# EAGLE design 4ButtonSwitch.ItsyBitsyM0.Rev1.1 (EAGLE 8.6.0)
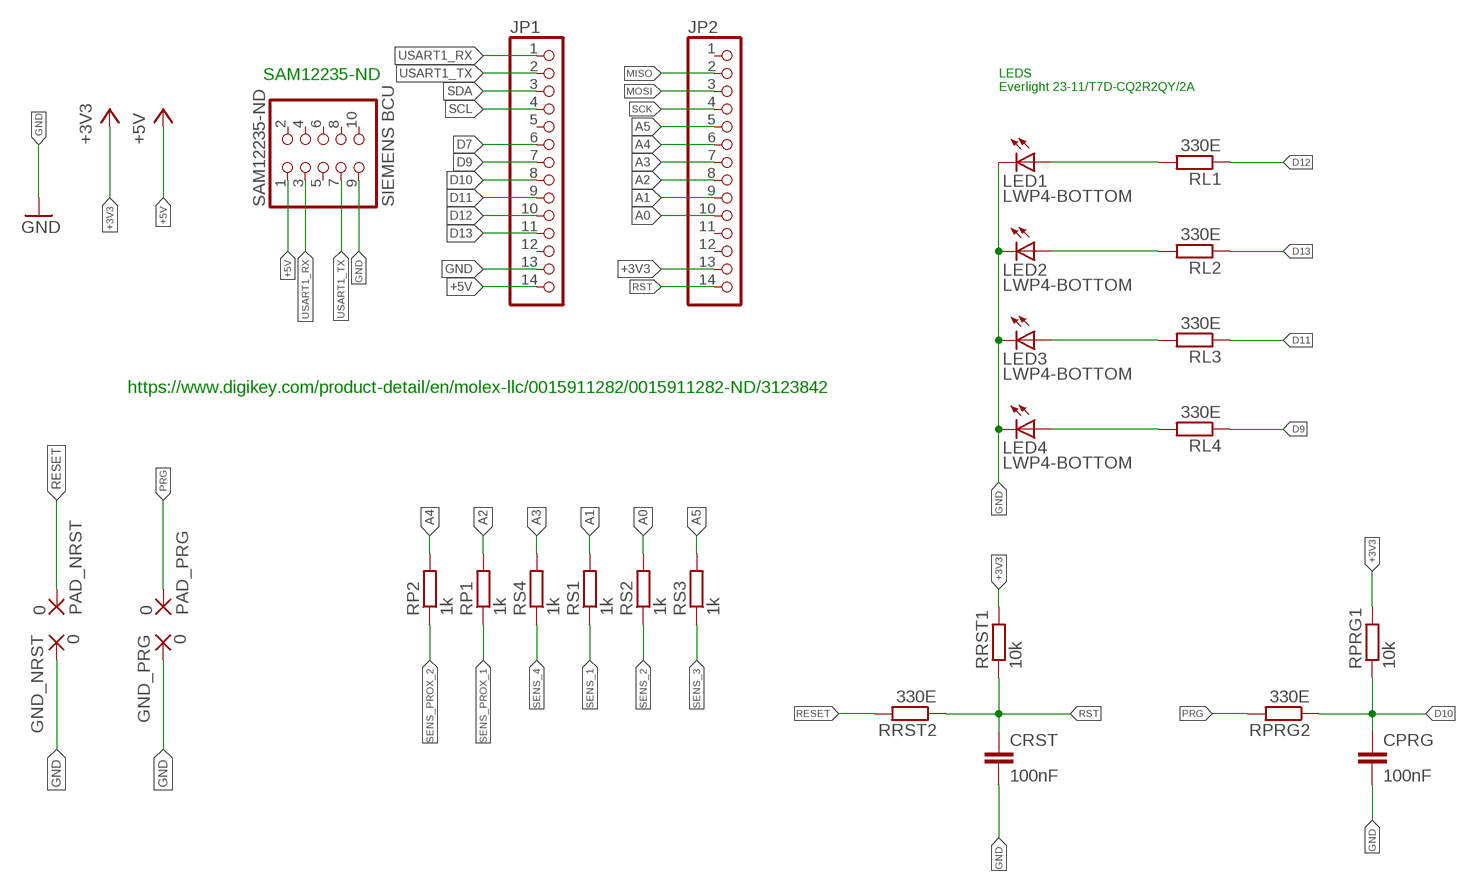
[diagram p0: schematic, sheet 1]

## Parts
CPRG  100nF  C-EUC1206  [C1206]
CRST  100nF  C-EUC1206  [C1206]
GND_NRST  0  SMD5  [SMD2,54-5,08]
GND_PRG  0  SMD5  [SMD2,54-5,08]
JP1  PINHD-1X141X14_SMT  [1X14_SMT]
JP2  PINHD-1X141X14_SMT  [1X14_SMT]
LED1  LWP4-BOTTOM  [P47F-BOTTOM]
LED2  LWP4-BOTTOM  [P47F-BOTTOM]
LED3  LWP4-BOTTOM  [P47F-BOTTOM]
LED4  LWP4-BOTTOM  [P47F-BOTTOM]
PAD_NRST  0  SMD5  [SMD2,54-5,08]
PAD_PRG  0  SMD5  [SMD2,54-5,08]
RL1  330E  R-EU_R1206  [R1206]
RL2  330E  R-EU_R1206  [R1206]
RL3  330E  R-EU_R1206  [R1206]
RL4  330E  R-EU_R1206  [R1206]
RP1  1k  R-EU_R1206  [R1206]
RP2  1k  R-EU_R1206  [R1206]
RPRG1  10k  R-EU_R1206  [R1206]
RPRG2  330E  R-EU_R1206  [R1206]
RRST1  10k  R-EU_R1206  [R1206]
RRST2  330E  R-EU_R1206  [R1206]
RS1  1k  R-EU_R1206  [R1206]
RS2  1k  R-EU_R1206  [R1206]
RS3  1k  R-EU_R1206  [R1206]
RS4  1k  R-EU_R1206  [R1206]
SAM12235-ND  SIEMENS BCU  PINHD-2X5_2.54-SMD  [2X05SMD]

## Nets
+3V3: JP2.13 RPRG1.2 RRST1.2
+5V: JP1.14 SAM12235-ND.1
A0: JP2.10 RS2.2
A1: JP2.9 RS1.2
A2: JP2.8 RP1.2
A3: JP2.7 RS4.2
A4: JP2.6 RP2.2
A5: JP2.5 RS3.2
D7: JP1.6
D9: JP1.7 RL4.1
D10: CPRG.1 JP1.8 RPRG1.1 RPRG2.1
D11: JP1.9 RL3.1
D12: JP1.10 RL1.1
D13: JP1.11 RL2.1
GND: CPRG.2 CRST.2 GND_NRST.1(P) GND_PRG.1(P) JP1.13 LED1.C LED2.C LED3.C LED4.C SAM12235-ND.9
MISO: JP2.2
MOSI: JP2.3
N$19: LED1.A RL1.2
N$20: LED2.A RL2.2
N$21: LED3.A RL3.2
N$22: LED4.A RL4.2
PRG: PAD_PRG.1(P) RPRG2.2
RESET: PAD_NRST.1(P) RRST2.2
RST: CRST.1 JP2.14 RRST1.1 RRST2.1
SCK: JP2.4
SCL: JP1.4
SDA: JP1.3
SENS_1: RS1.1
SENS_2: RS2.1
SENS_3: RS3.1
SENS_4: RS4.1
SENS_PROX_1: RP1.1
SENS_PROX_2: RP2.1
USART1_RX: JP1.1 SAM12235-ND.3
USART1_TX: JP1.2 SAM12235-ND.7
Unconnected: JP1.5 JP1.12 JP2.1 JP2.11 JP2.12 SAM12235-ND.2 SAM12235-ND.4 SAM12235-ND.5 SAM12235-ND.6 SAM12235-ND.8 SAM12235-ND.10

## Notes on the sheet
- SAM12235-ND
- LEDS
  Everlight 23-11/T7D-CQ2R2QY/2A
- https://www.digikey.com/product-detail/en/molex-llc/0015911282/0015911282-ND/3123842

## Library data of the parts
CPRG CRST = rcl:C-EU: CAPACITOR, European symbol; SPICEPREFIX: C
GND_NRST GND_PRG PAD_NRST PAD_PRG = wirepad:SMD5: SMD PAD
JP1 JP2 = pinhead+:PINHD-1X14: PIN HEADER
LED1-LED4 = led:*P4: PointLED® Enhanced Thinfilm LED TOP & BOTTOM mount LS P47F, LR P47F, LA P47F, LY P47F, LT P4SG, LB P4SG, LW P4SG Source: http://catalog.osram-os.com .. LA_LR_LS_LY_P47F_Pb_free.pdf
RL1-RL4 RP1 RP2 RPRG1 RPRG2 RRST1 RRST2 RS1-RS4 = resistor:R-EU_: RESISTOR, European symbol
SAM12235-ND = pinhead:PINHD-2X5: PIN HEADER

## Board
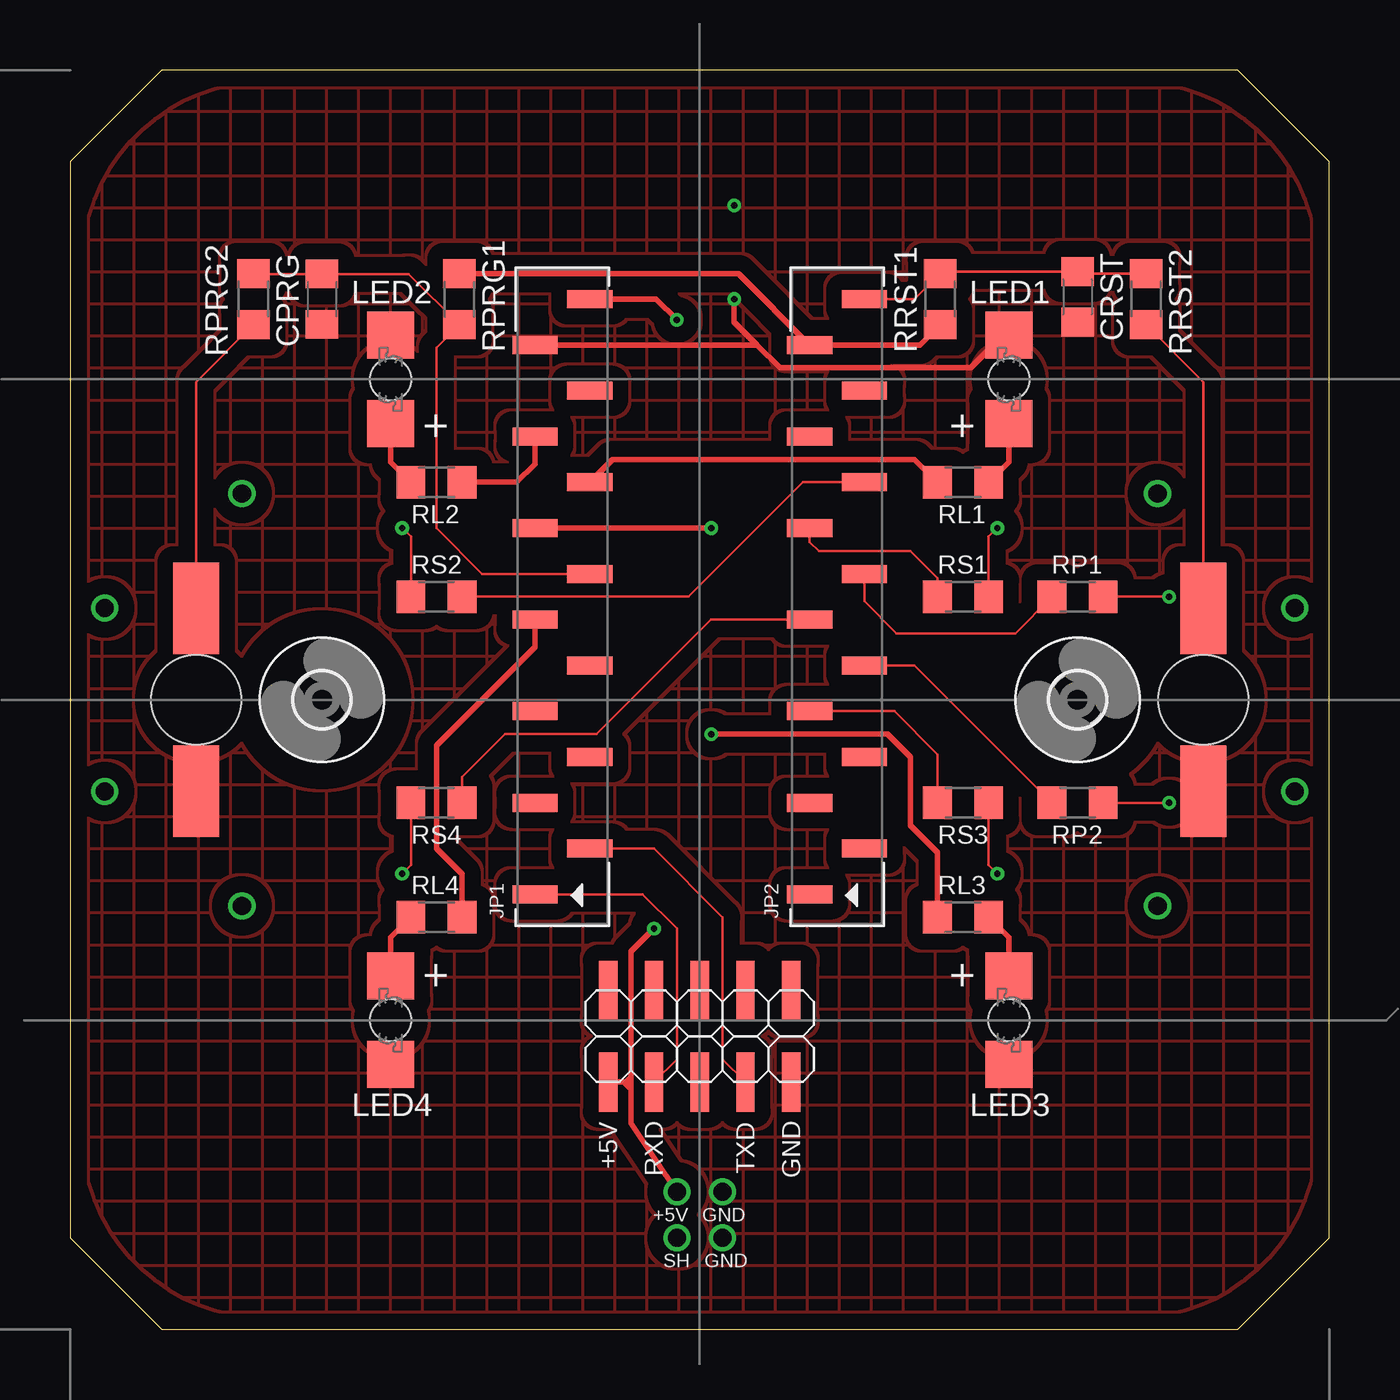
[diagram p1: board, top side]
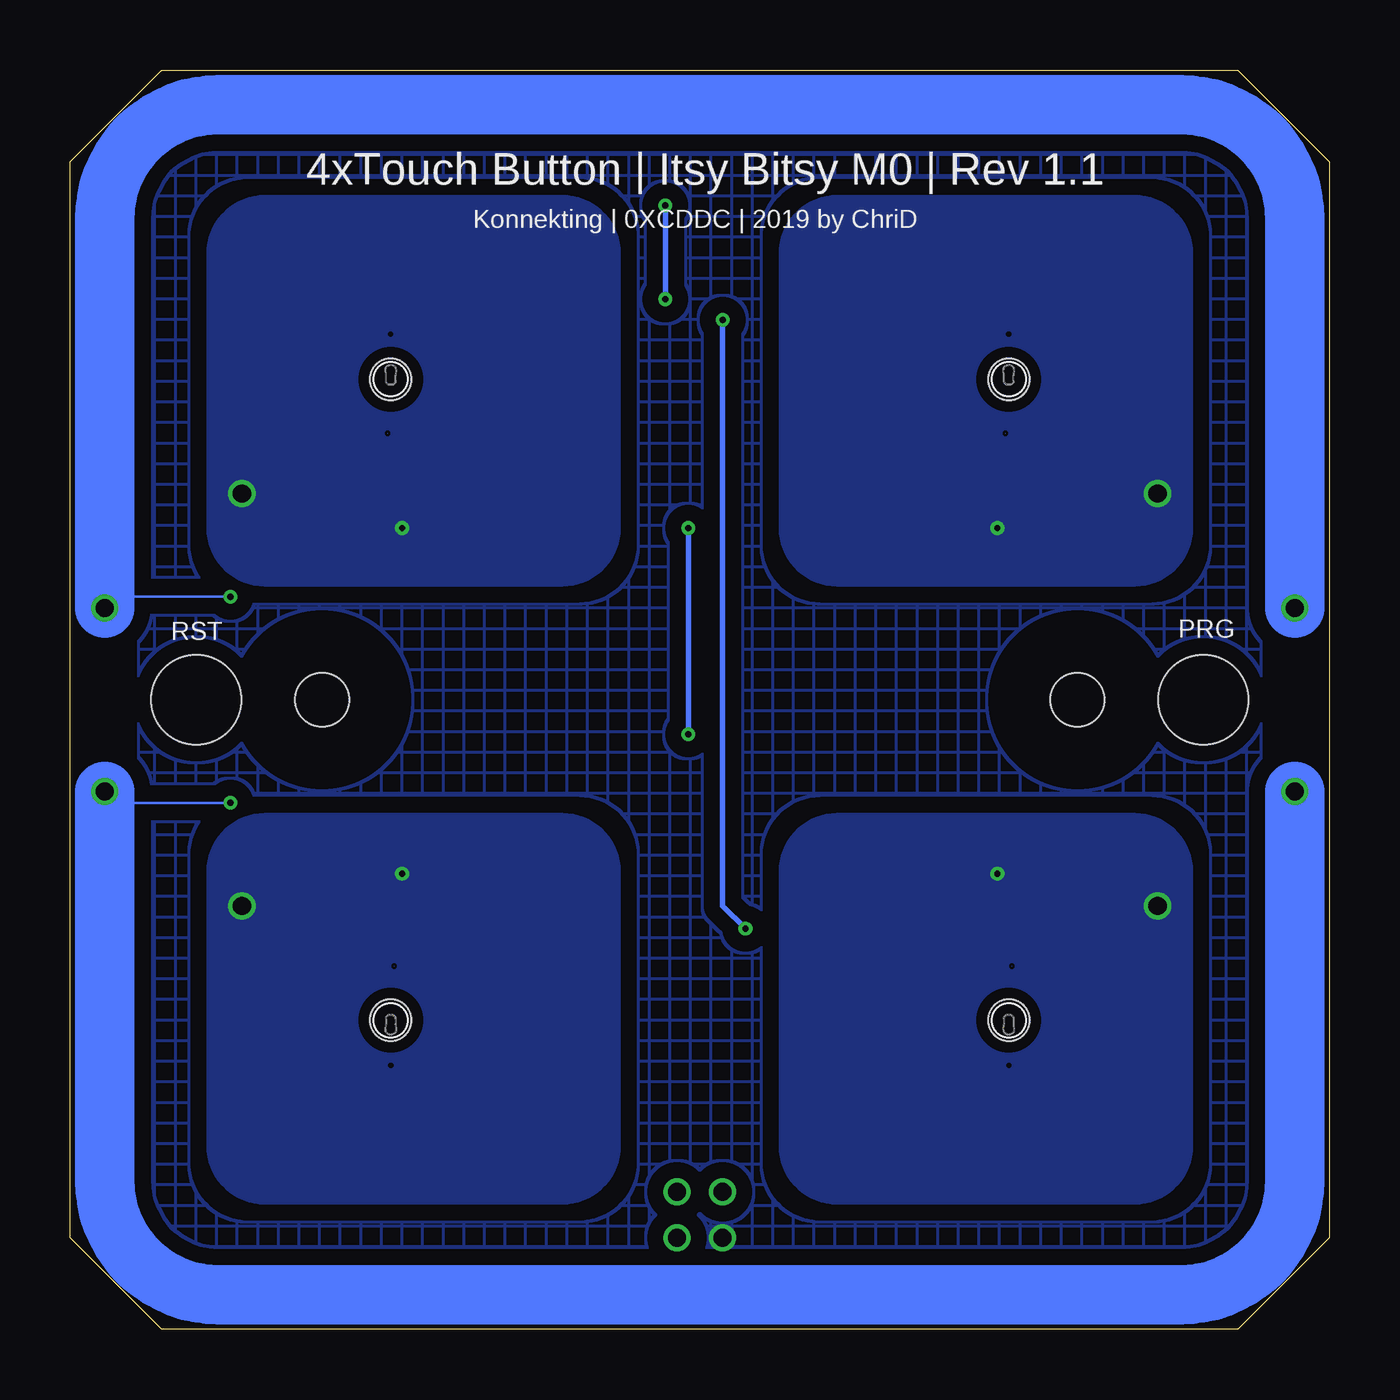
[diagram p2: board, bottom side, seen from below]

Size 69.85 x 69.85 mm. Coordinates in mm from the lower left corner, seen from the top.
Outline: 5.08,69.85 64.77,69.85 69.85,64.77 69.85,5.08 64.77,0 5.08,0 0,5.08 0,64.77 5.08,69.85
Outline: 6.34,69.84 5.08,69.85
Copper layers (1*16): Top 0.035mm / dielectric 1.5mm / Bottom 0.035mm
Design rules "konnektduino": minimum track width 6mil, minimum drill 0.35mm, track to track 6mil, track to pad 6mil, pad to pad 6mil, via to via 6mil, smd to smd 6mil, copper to edge 25mil, drill to drill 6mil, minimum pad ring 10mil, minimum via ring 8mil, stop-mask expansion 1mil, vias tented up to drill 25mil, thermal gap 10mil
Holes 5 mm at 62.87,34.92 6.99,34.92

### Footprints (pad centres in the part's own frame; a part is rotated, then mirrored left to right if it is on the bottom)
C1206 = smd 1.6 x 1.8: 1 -1.4,0; 2 1.4,0
SMD2,54-5,08 = smd 2.54 x 5.08: 1 0,0
1X14_SMT = smd 1 x 2.5: 1 -16.51,1.52; 2 -13.97,-1.52; 3 -11.43,1.52; 4 -8.89,-1.52; 5 -6.35,1.52; 6 -3.81,-1.52; 7 -1.27,1.52; 8 1.27,-1.52; 9 3.81,1.52; 10 6.35,-1.52; 11 8.89,1.52; 12 11.43,-1.52; 13 13.97,1.52; 14 16.51,-1.52
P47F-BOTTOM = smd 2.6 x 2.6: A -2.45,0; C 2.45,0 | hole 2.3: 0,0
R1206 = smd 1.6 x 1.803: 1 -1.422,0; 2 1.422,0
2X05SMD = smd 1.016 x 3.302: 1 -1.27,-3.81; 2 -1.27,1.27; 3 1.27,-3.81; 4 1.27,1.27; 5 3.81,-3.81; 6 3.81,1.27; 7 6.35,-3.81; 8 6.35,1.27; 9 8.89,-3.81; 10 8.89,1.27
3,0 = hole 3: 0,0

### Placement (x,y rotation side)
CPRG  13.97,57.15 270 top
CRST  55.88,57.28 270 top
GND_NRST  6.99,29.84 0 top
GND_PRG  62.87,29.84 0 top
JP1  27.3,40.64 90 top
JP2  42.55,40.64 90 top
LED1  52.07,52.7 90 top
LED2  17.78,52.7 90 top
LED3  52.07,17.14 270 top
LED4  17.78,17.14 270 top
PAD_NRST  62.87,40.01 0 top
PAD_PRG  6.99,40.01 0 top
RL1  49.53,46.99 0 top
RL2  20.32,46.99 180 top
RL3  49.53,22.86 0 top
RL4  20.32,22.86 180 top
RP1  55.88,40.64 180 top
RP2  55.88,29.21 180 top
RPRG1  21.59,57.15 90 top
RPRG2  10.16,57.15 270 top
RRST1  48.26,57.15 270 top
RRST2  59.69,57.15 270 top
RS1  49.53,40.64 180 top
RS2  20.32,40.64 0 top
RS3  49.53,29.21 180 top
RS4  20.32,29.21 0 top
SAM12235-ND  31.11,17.53 0 top
U$1  [3,0]  13.97,34.92 0 top
U$2  [3,0]  55.88,34.92 0 top

### Tracks (layer width: path | path; a pad name or v marks a point on that pad's centre or on a via)
+3V3
  Top 0.305: RPRG1.2 37.06,58.57 JP2.13 47.14,54.61 RRST1.2
+5V  (via drill 0.35, 1)
  Top 0.305: SAM12235-ND.1 30.73,13.72 | 30.73,13.72 30.86,13.72 31.11,13.97 | JP1.14 32.51,57.15 v33.66,56.01 | v33.66,7.62 31.11,11.43 31.11,13.34 | 31.11,13.34 31.11,13.97 | 30.73,13.72 31.11,13.34 | 31.11,13.97 31.11,20.95 v32.38,22.23
  Bottom 0.305: v32.38,22.23 33.66,23.5 v33.66,56.01
A0
  Top 0.152: RS2.2 34.29,40.64 40.64,46.99 JP2.10
A1
  Top 0.152: JP2.9 41.02,43.68 41.53,43.18 46.61,43.18 48.11,41.68 RS1.2
A2
  Top 0.152: JP2.8 44.06,40.39 45.85,38.61 52.43,38.61 RP1.2
A3
  Top 0.152: RS4.2 21.74,30.63 24.13,33.02 29.21,33.02 35.56,39.37 JP2.7
A4
  Top 0.152: JP2.6 46.84,36.83 RP2.2
A5
  Top 0.152: RS3.2 48.11,31.9 45.72,34.29 JP2.5
D9
  Top 0.305: RL4.1 21.74,25.25 20.32,26.67 20.32,32.38 25.79,37.85 JP1.7
D10
  Top 0.152: RPRG2.1 10.18,58.55 CPRG.1 18.77,58.55 RPRG1.1 20.32,54.46 20.32,44.45 22.86,41.91 JP1.8
D11  (via drill 0.35)
  Top 0.305: v35.56,44.45 JP1.9 | v35.56,33.02 45.34,33.02 46.61,31.75 46.61,27.94 48.11,26.44 RL3.1
  Bottom 0.305: v35.56,44.45 v35.56,33.02
D12
  Top 0.305: RL1.1 46.84,48.26 30.09,48.26 JP1.10
D13
  Top 0.305: JP1.11 25.79,48.01 24.77,46.99 RL2.1
GND  (via drill 0.35, 1)
  Top 0.305: 38.1,54.61 39.37,53.34 49.97,53.34 51.27,54.64 51.56,54.64 LED1.C | JP1.13 38.1,54.61 | 38.1,54.61 36.83,55.88 v36.83,57.15
  Bottom 0.305: v36.83,57.15 v36.83,62.36
  other vias: 36.2,7.62 36.2,5.08
  pour Top (isolate 0.889, rank 6, no thermals, hatched): 0.64,10.79 arc90 10.79,0.64 59.05,0.64 arc90 69.22,10.79 69.22,59.05 arc90 59.05,69.22 10.79,69.22 arc90 0.64,59.05
N$19
  Top 0.305: LED1.A 52.07,48.11 RL1.2
N$20
  Top 0.305: LED2.A 17.78,48.11 RL2.2
N$21
  Top 0.305: LED3.A 52.07,21.74 RL3.2
N$22
  Top 0.305: LED4.A 17.78,21.74 RL4.2
PRG
  Top 0.152: PAD_PRG.1 6.99,52.55 RPRG2.2
RESET
  Top 0.152: PAD_NRST.1 62.87,52.55 RRST2.2
RST
  Top 0.152: RRST2.1 55.99,58.57 CRST.1 48.37,58.68 RRST1.1 46.84,57.15 JP2.14
SENS_1  (via drill 0.35, 1)
  Top 0.152: RS1.1 50.95,43.97 v51.44,44.45
  other vias: 60.33,46.35
  pour Bottom: 39.37,59.69 39.37,44.45 arc90 42.55,41.27 59.05,41.27 arc90 62.23,44.45 62.23,59.69 arc90 59.05,62.87 42.55,62.87 arc90
SENS_2  (via drill 0.35, 1)
  Top 0.152: RS2.1 18.9,43.97 v18.41,44.45
  other vias: 9.53,46.35
  pour Bottom: 10.79,41.27 27.3,41.27 arc90 30.48,44.45 30.48,59.69 arc90 27.3,62.87 10.79,62.87 arc90 7.62,59.69 7.62,44.45 arc90
SENS_3  (via drill 0.35, 1)
  Top 0.152: RS3.1 50.95,25.76 v51.44,25.27
  other vias: 60.33,23.5
  pour Bottom: 59.05,28.57 42.55,28.57 arc90 39.37,25.4 39.37,10.16 arc90 42.55,6.99 59.05,6.99 arc90 62.23,10.16 62.23,25.4 arc90
SENS_4  (via drill 0.35, 1)
  Top 0.152: RS4.1 18.9,25.76 v18.41,25.27
  other vias: 9.53,23.5
  pour Bottom: 7.62,10.16 7.62,25.4 arc-90 10.79,28.57 27.3,28.57 arc-90 30.48,25.4 30.48,10.16 arc-90 27.3,6.99 10.79,6.99 arc-90
SENS_PROX_1  (via drill 0.35, 1)
  Top 0.152: RP1.1 v60.96,40.64
  Bottom 0.152: v67.94,40.01 67.31,40.64 v60.96,40.64
  Bottom 3.302: v1.91,40.01 1.91,61.59 arc-90 8.26,67.94 61.59,67.94 arc-90 67.94,61.59 v67.94,40.01
SENS_PROX_2  (via drill 0.35, 1)
  Top 0.152: RP2.1 v60.96,29.21
  Bottom 0.152: v60.96,29.21 67.31,29.21 v67.94,29.84
  Bottom 3.302: v1.91,29.84 1.91,8.26 arc90 8.26,1.91 61.59,1.91 arc90 67.94,8.26 v67.94,29.84
SHIELD_OR_GND  (via drill 1)
  other vias: 33.66,5.08
  pour Bottom (isolate 0.889, rank 6, no thermals, hatched): 3.81,9.53 arc90 9.53,3.81 60.33,3.81 arc90 66.04,9.53 66.04,60.33 arc90 60.33,66.04 9.53,66.04 arc90 3.81,60.33
USART1_RX
  Top 0.152: JP1.1 31.75,24.13 33.66,22.23 33.66,14.99 SAM12235-ND.3
USART1_TX
  Top 0.152: SAM12235-ND.7 36.2,14.99 36.2,22.86 32.38,26.67 JP1.2

### Text on the board
tNames: + | + | + | + | +5V | RXD | TXD | GND | +5V | GND | SH | GND
bNames: 4xTouch Button | Itsy Bitsy M0 | Rev 1.1 | Konnekting | 0XCDDC | 2019 by ChriD | PRG | RST